# EAGLE design M_D_ext_power_8_0_2 (EAGLE 9.6.2)
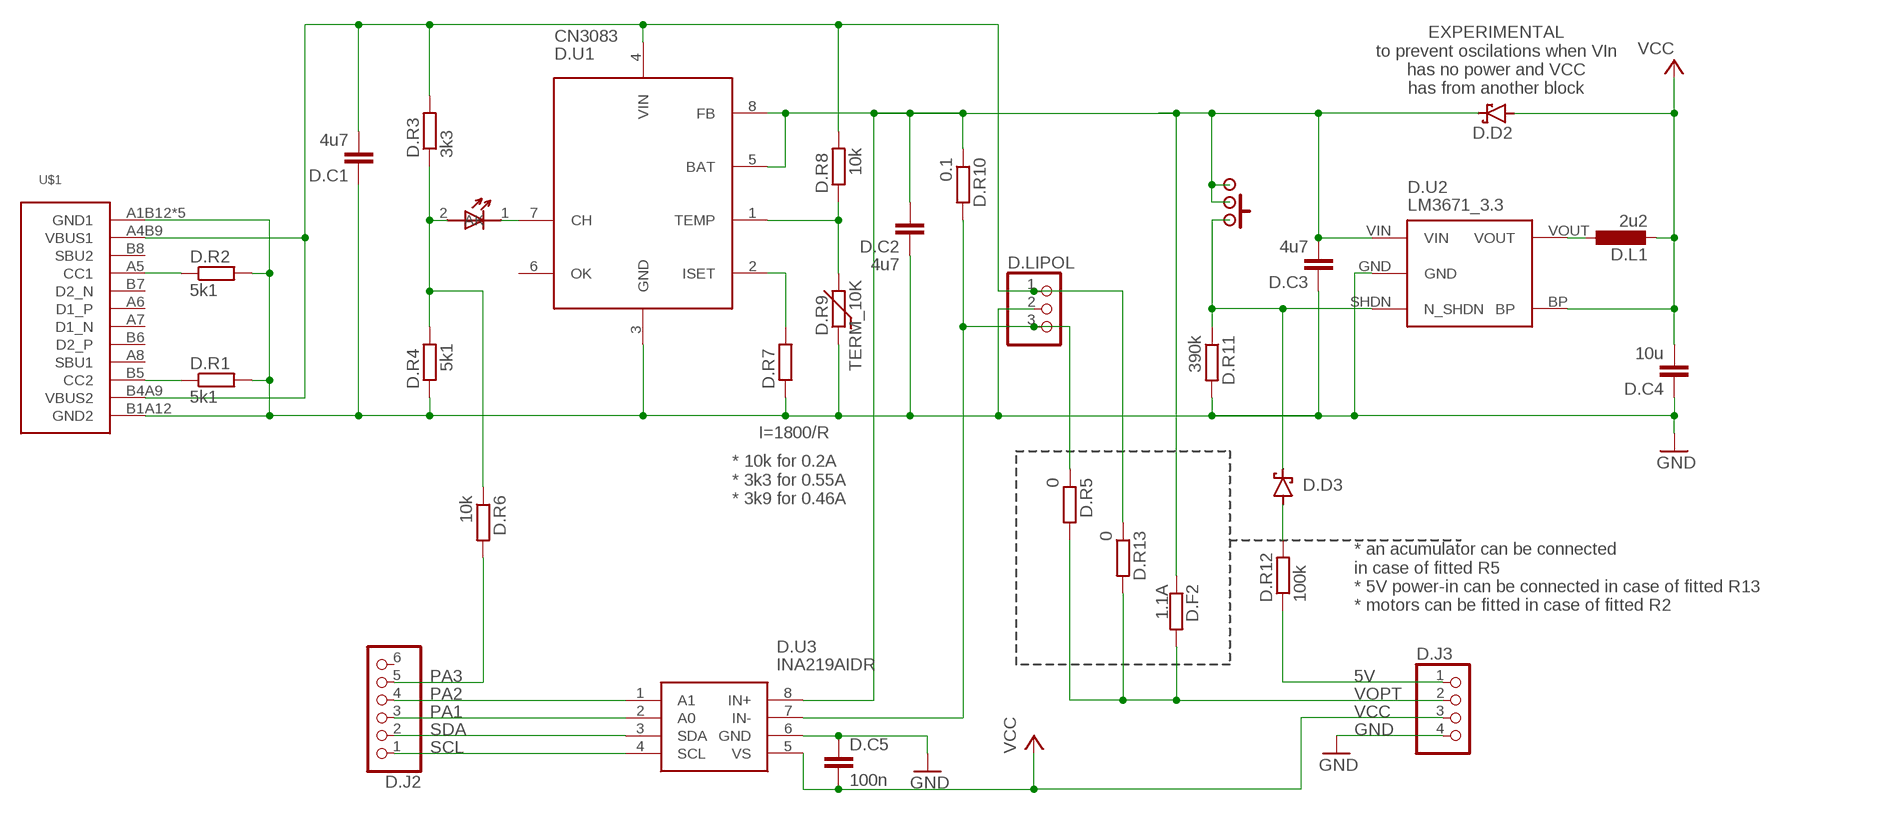
[diagram p0: schematic, sheet 1]

## Parts
D.C1  4u7  C-EUC0603  [C0603]
D.C2  4u7  C-EUC0603  [C0603]
D.C3  4u7  C-EUC0603  [C0603]
D.C4  10u  C-EUC0805  [C0805]
D.C5  100n  C-EUC0603  [C0603]
D.D1  LED_1.8  [LED_1.8]
D.D2  SHOTKY_2.8  [SHOTKY_2.8]
D.D3  SHOTKY_2.8  [SHOTKY_2.8]
D.F2  1.1A  R-EU_R0805  [R0805]
D.J2  PINHD-1X6  [1X06]
D.J3  PINHD-1X4  [1X04]
D.L1  2u2  L-EUL3230M  [L3230M]
D.LIPOL  PINHEAD-1X3-2  [1X-03-2]
D.ON/OFF/RESET  SWITCH  [SWITCH]
D.R1  5k1  R-EU_R0603  [R0603]
D.R2  5k1  R-EU_R0603  [R0603]
D.R3  3k3  R-EU_R0603  [R0603]
D.R4  5k1  R-EU_R0603  [R0603]
D.R5  0  R-EU_R0603  [R0603]
D.R6  10k  R-EU_R0603  [R0603]
D.R7  I=1800/R  R-EU_R0603  [R0603]
D.R8  10k  R-EU_R0603  [R0603]
D.R9  TERM_10K  THERM  [THERM]
D.R10  0.1  R-EU_R0805  [R0805]
D.R11  390k  R-EU_R0603  [R0603]
D.R12  100k  R-EU_R0603  [R0603]
D.R13  0  R-EU_R0603  [R0603]
D.U1  CN3083  [SOP8]
D.U2  LM3671_3.3  STABILISER_APE8865  [SOT32-5]
D.U3  INA219AIDR  [SOIC127P600X175-8N]
U$1  USB-C  [USB-C]

## Nets
5V: D.C1.2 D.LIPOL.1 D.R3.2 D.R8.2 D.R13.1 D.U1.4(VIN) U$1.A4B9(VBUS1) U$1.B4A9(VBUS2)
CHRG: D.D1.2(A) D.R3.1 D.R4.2 D.R6.1
GND: D.C1.1 D.C2.1 D.C3.1 D.C4.1 D.C5.1 D.J3.4 D.LIPOL.2 D.R1.2 D.R2.2 D.R4.1 D.R7.1 D.R9.1 D.R11.2 D.U1.3(GND) D.U2.GND D.U3.6(GND) U$1.A1B12(GND1) U$1.B1A12(GND2) U$1.SH1(GND1) U$1.SH2(GND1) U$1.SH3(GND1) U$1.SH4(GND1)
IN+: D.LIPOL.3 D.R5.1 D.R10.2 D.U3.7(IN-)
IN-: D.C2.2 D.C3.2 D.D2.K(C) D.F2.1 D.ON/OFF/RESET.P$2 D.ON/OFF/RESET.P$3 D.ON/OFF/RESET.P$4 D.ON/OFF/RESET.P$6 D.R10.1 D.U1.5(BAT) D.U1.8(FB) D.U2.VIN D.U3.8(IN+)
N$2: D.L1.1 D.U2.VOUT
N$3: D.D1.1(K) D.U1.7(CH)
N$4: D.R1.1 U$1.B5(CC2)
N$5: D.D3.A D.R12.2
N$6: D.R2.1 U$1.A5(CC1)
N$7: D.R7.2 D.U1.2(ISET)
N$8: D.R8.1 D.R9.2 D.U1.1(TEMP)
N$10: D.D3.K(C) D.ON/OFF/RESET.P$1 D.ON/OFF/RESET.P$5 D.ON/OFF/RESET.P$7 D.R11.1 D.U2.SHDN(N_SHDN)
PA1: D.J2.3 D.U3.2(A0)
PA2: D.J2.4 D.U3.1(A1)
PA3: D.J2.5 D.R6.2
PA5-1: D.J3.1 D.R12.1
SCL: D.J2.1 D.U3.4(SCL)
SDA: D.J2.2 D.U3.3(SDA)
VCC: D.C4.2 D.C5.2 D.D2.A D.J3.3 D.L1.2 D.U2.BP D.U3.5(VS)
VOPT: D.F2.2 D.J3.2 D.R5.2 D.R13.2
Unconnected: D.J2.6 D.U1.6(OK) U$1.A6(D1_P) U$1.A7(D1_N) U$1.A8(SBU1) U$1.B6(D2_P) U$1.B7(D2_N) U$1.B8(SBU2)

## Notes on the sheet
- EXPERIMENTAL
  to prevent oscilations when VIn
  has no power and VCC
  has from another block
- * 10k for 0.2A
  * 3k3 for 0.55A
  * 3k9 for 0.46A
- * an acumulator can be connected 
  in case of fitted R5  
  * 5V power-in can be connected in case of fitted R13 
  * motors can be fitted in case of fitted R2

## Library data of the parts
D.C1-D.C5 = rcl:C-EU: CAPACITOR, European symbol; SPICEPREFIX: C
D.D1 = hugo:LED_1.8
D.D2 D.D3 = hugo:SHOTKY_2.8
D.F2 D.R1-D.R8 D.R10-D.R13 = rcl:R-EU_: RESISTOR, European symbol; SPICEPREFIX: R
D.J2 = pinhead2:PINHD-1X6: PIN HEADER
D.J3 = pinhead2:PINHD-1X4: PIN HEADER
D.L1 = rcl:L-EU: INDUCTOR, European symbol; SPICEPREFIX: L
D.LIPOL = pinhead2:PINHEAD-1X3-2
D.ON/OFF/RESET = hugo:SWITCH
D.R9 = hugo:THERM
D.U1 = hugo:CN3083
D.U2 = !stavebnice03:STABILISER_APE8865
D.U3 = SamacSys_Parts:INA219AIDR: 26-V, Bidirectional, Zero-Drift, High-Side, I2C Out Current/Power Monitor Source: Datasheet <http://www.ti.com/lit/gpn/ina219>; DESCRIPTION: 26-V, Bidirectional, Zero-Drift, High-Side, I2C Out Current/Power Monitor; HEIGHT: 1.75mm; MANUFACTURER_NAME: Texas Instruments; MANUFACTURER_PART_NUMBER: INA219AIDR; MOUSER_PART_NUMBER: 595-INA219AIDR; MOUSER_PRICE-STOCK: https://www.mouser.co.uk/ProductDetail/Texas-Instruments/INA219AIDR?qs=XGzIaZb%2FFYIE5YcOHTnKDA%3D%3D
U$1 = hugo:USB-C

## Board
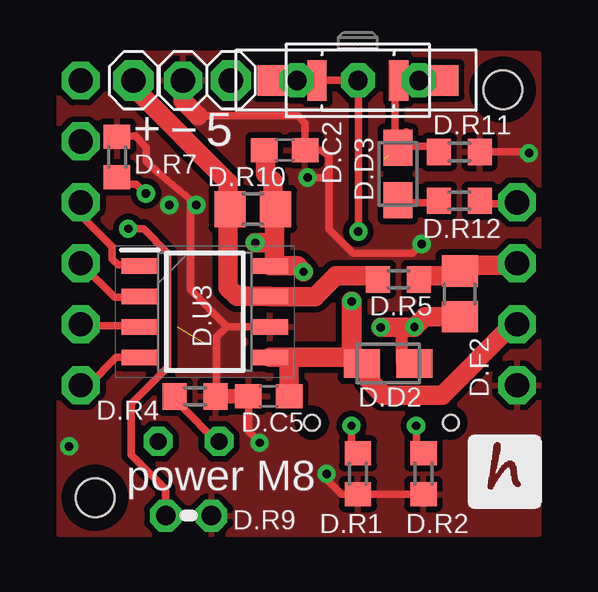
[diagram p1: board, top side]
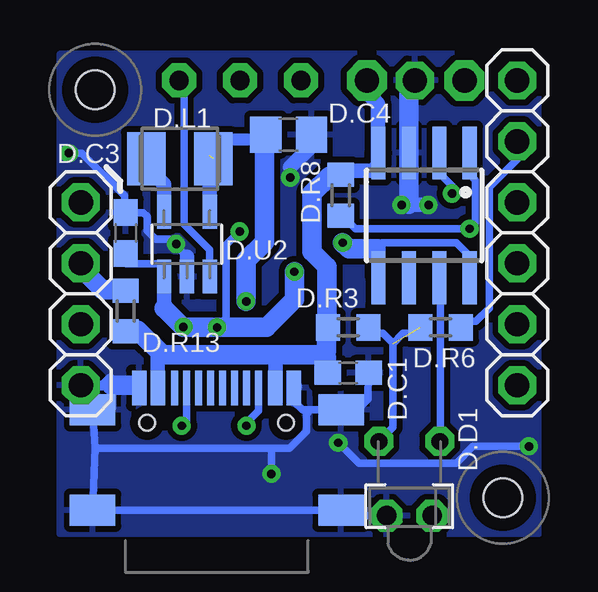
[diagram p2: board, bottom side, seen from below]

No outline drawn. Coordinates in mm, seen from the top.
Copper layers (1*16): Top 0.035mm / dielectric 1.5mm / Bottom 0.035mm
Design rules "default *": minimum track width 10mil, minimum drill 0.35mm, track to track 6mil, track to pad 6mil, pad to pad 6mil, via to via 10mil, smd to smd 10mil, copper to edge 15mil, drill to drill 15mil, minimum pad ring 10mil, minimum via ring 8mil, stop-mask expansion 4mil, vias tented up to drill 14mil, thermal gap 10mil
Holes 1.6 mm at 2,2 19,19
tRestrict: area 18,18 to 20,20; area 1,1 to 3,3
bRestrict: area 1,1 to 3,3; area 18,18 to 20,20

### Footprints (pad centres in the part's own frame; a part is rotated, then mirrored left to right if it is on the bottom)
C0603 = smd 1.1 x 1: 1 -0.85,0; 2 0.85,0
C0805 = smd 1.3 x 1.5: 1 -0.95,0; 2 0.95,0
LED_1.8 = drill 0.7 octagon: 1 -1.27,-0.4; 2 1.27,-0.4
SHOTKY_2.8 = smd 1.5 x 1.2: A -1.1,0; K 1.1,0
R0805 = smd 1.3 x 1.5: 1 -0.95,0; 2 0.95,0
1X06 = drill 1.016 pad 1.575 octagon: 1 -6.35,0; 2 -3.81,0; 3 -1.27,0; 4 1.27,0; 5 3.81,0; 6 6.35,0
1X04 = drill 1.016 pad 1.575 octagon: 1 -3.81,0; 2 -1.27,0; 3 1.27,0; 4 3.81,0
L3230M = smd 1.6 x 2.2: 1 -1.4,0; 2 1.4,0
1X-03-2 = drill 1.016 pad 1.676 octagon: 1 -2.016,0; 3 2.048,0 | drill 1.016 pad 1.575 octagon: 2 -0.016,0
SWITCH = drill 0.8 pad 1.422 octagon: P$1 2.54,0; P$2 0,0; P$3 -2.54,0 | smd 0.8 x 1.7: P$4 -1.7,0; P$5 1.7,0 | smd 1.27 x 1.27: P$6 -3.556,0; P$7 3.556,0
R0603 = smd 1 x 1.1: 1 -0.85,0; 2 0.85,0
THERM = drill 0.813 octagon: 1 -0.953,0; 2 0.953,0
SOP8 = smd 0.6 x 2.2: 1 -1.905,-2.6; 2 -0.635,-2.6; 3 0.635,-2.6; 4 1.905,-2.6; 5 1.905,2.6; 6 0.635,2.6; 7 -0.635,2.6; 8 -1.905,2.6
SOT32-5 = smd 0.6 x 1.4: BP 0.95,1.35; GND 0,-1.35; SHDN 0.95,-1.35; VIN -0.95,-1.35; VOUT -0.95,1.35
SOIC127P600X175-8N = smd 1.528 x 0.65: 1 -2.711,1.905; 2 -2.711,0.635; 3 -2.711,-0.635; 4 -2.711,-1.905; 5 2.711,-1.905; 6 2.711,-0.635; 7 2.711,0.635; 8 2.711,1.905
USB-C = smd 0.6 x 1.45: A1B12 -3.235,3.825; A4B9 -2.46,3.825; B1A12 3.215,3.825; B4A9 2.44,3.825 | smd 0.3 x 1.45: A5 -1.26,3.825; A6 -0.26,3.825; A7 0.24,3.825; A8 1.24,3.825; B5 1.74,3.825; B6 0.74,3.825; B7 -0.76,3.825; B8 -1.76,3.825 | smd 1.9 x 1.3: SH1 -5.18,2.91; SH2 -5.18,-1.27; SH3 5.18,-1.27; SH4 5.18,2.91 | hole 0.65: 2.88,2.38; -2.9,2.38

### Placement (x,y rotation side)
D.C1  8.45,7.2 180 bottom
D.C2  9.91,16.49 180 top
D.C3  17.73,13.03 270 bottom
D.C4  10.93,17.13 180 bottom
D.C5  9.25,6.22 0 top
D.D1  5.9,3.95 180 bottom
D.D2  14.22,7.59 0 top
D.D3  14.63,15.49 90 top
D.F2  17.21,10.5 90 top
D.J2  1.4,13.04 90 bottom
D.J3  19.6,10.5 270 bottom
D.L1  15.47,16.13 0 bottom
D.LIPOL  5.65,19.39 180 top
D.ON/OFF/RESET  12.96,19.39 0 top
D.R1  12.96,3 270 top
D.R2  15.7,3 270 top
D.R3  8.45,9.1 180 bottom
D.R4  6.17,6.22 180 top
D.R5  14.66,11.1 0 top
D.R6  4.6,9.1 0 bottom
D.R7  2.91,16.2 270 top
D.R8  8.76,14.61 90 bottom
D.R9  5.9,1.25 180 top
D.R10  8.58,14.03 180 top
D.R11  17.2,16.41 0 top
D.R12  17.2,14.38 180 top
D.R13  17.73,9.78 90 bottom
D.U1  5.28,13.77 180 bottom
D.U2  15.18,12.57 0 bottom
D.U3  6.58,9.75 0 top
U$1  13.93,2.75 0 bottom

### Tracks (layer width: path | path; a pad name or v marks a point on that pad's centre or on a via)
5V
  Bottom 0.254: D.R13.1 17.27,8.93 17.22,8.98 | 16.28,7.96 16.2,7.96
  Bottom 0.305: D.R3.2 9.36,9.16
  Bottom 0.61: 11.49,7.02 U$1.B4A9 11.49,7.87 11.4,7.96 | D.U1.4 7.21,16.37 | 7.21,16.37 7.21,15.86 7.44,15.63 8.59,15.63 D.R8.2 8.81,15.46 8.87,15.4 | U$1.A4B9 16.39,7.84 16.28,7.96 | 7.21,16.37 7.21,18.42 7.73,18.94 D.LIPOL.1
  Bottom 0.813: 8.87,15.4 9.23,15.4 9.95,14.68 9.95,12.25 9.32,11.62 9.32,9.07 | D.C1.2 9.33,7.23 9.35,7.84 9.46,7.96 9.51,7.96 | 9.51,7.96 11.4,7.96 16.2,7.96 17.22,8.98 | D.R3.2 9.32,9.07 | 9.32,9.07 9.35,9.05 9.35,8.12 9.51,7.96
CHRG  (1 unrouted)
  Top 0.305: D.R4.2 5.58,5.97 5.58,5.82 7.05,4.35 D.D1.2
  Bottom 0.254: D.R6.1 5.64,9.1 5.89,8.85
  Bottom 0.305: D.R3.1 7.61,8.85 7,8.85 6.59,8.44 | 5.89,8.85 6.16,8.85 6.59,8.41 6.59,4.94 D.D1.2
GND  (via drill 0.35)
  Top 0.305: v11.65,3 11.65,2.77 12.27,2.15 D.R1.2 D.R2.2 | 2.86,17.13 D.R7.1 | D.R7.1 3.14,16.86 | D.R7.1 3.67,17.08 4.14,16.61 4.14,16.03 4.61,15.55 v6.22,14.2 5.98,14.37 5.98,10.66 7.51,9.13 7.07,8.7 7.07,6.27 D.R4.1 | D.U3.6 7.52,9.12 | D.R11.2 20.04,16.41 v20.09,16.36 | v15.62,12.57 15.24,12.19 12.75,12.19 11.76,13.18 11.76,16.2 11.47,16.49 D.C2.1 10.76,17.61 10.46,17.91 6.3,17.91 | v10.87,15.34 11.57,15.34 | v8.87,4.29 8.4,4.76 D.C5.1
  Top 0.61: 8.38,6.21 8.09,6.22 8.02,6.22 D.R4.1 | 5.67,18.54 D.LIPOL.2
  Top 0.813: D.C5.1 8.38,6.21 | 6.3,17.91 5.67,18.54
  Bottom 0.305: 11.65,4.07 18.99,4.07 19.01,4.09 | U$1.SH4 8.92,5.71 9.45,5.71 9.33,5.59 8.13,5.59 7.62,6.1 D.C1.1 | U$1.SH1 19.01,4.09 | 19.01,4.09 U$1.SH2 U$1.SH3 8.64,1.25 D.R9.1 | 11.65,3.13 v11.65,3 | v11.65,3 11.63,2.97 | v11.65,3 11.65,4.07 | U$1.B1A12 10.71,6.01 10.37,5.66 U$1.SH4 | 11.65,4.07 10.89,4.07 10.19,4.78 10.19,5.49 10.02,5.66 U$1.SH4 | v20.09,16.36 19.56,16.36 17.78,14.58 17.78,13.93 D.C3.1 16.99,13.88 16.84,13.73 16.84,13.12 16.82,13.12 16.49,12.78 15.9,12.78 15.18,12.05 | v0.91,4.14 3.24,4.14 3.95,3.44 8.01,3.44 v8.87,4.29
  Bottom 0.406: 18.37,6.98 18.5,6.85 | 18.5,6.85 18.66,6.69 | U$1.A1B12 17.16,6.6 17.33,6.77 17.41,6.69 | 18.66,6.69 D.J3.4 19.6,6.25 | 18.66,6.69 18.31,6.69 | 18.5,6.85 18.34,6.68 18.34,5.71
  Bottom 0.508: 10.87,15.77 v10.87,15.34
  Bottom 0.61: 8.81,5.84 8.87,5.79 U$1.SH4 8.74,5.79 | 19.6,6.25 U$1.SH1 | U$1.B1A12 10.66,6.63 | D.U1.3 5.92,17.55 | v5.1,14.2 5.92,14.2 5.92,14.23 5.95,14.2 v6.22,14.2 | D.U2.GND 15.18,12.05 | D.LIPOL.2 5.92,19.21 | D.C4.1 9.98,16.65 10.87,15.77
  Bottom 0.813: 18.31,6.69 17.41,6.69 | 5.92,14.23 D.U1.3 5.92,19.21
  pour Top (isolate 0.254): 0.5,20.5 0.5,0.5 20.5,0.5 20.5,20.5
  pour Bottom (isolate 0.254, rank 3): 0.5,20.5 20.5,20.5 20.5,0.5 0.5,0.5
IN+
  Top 0.813: D.LIPOL.3 3.65,19.05 7.55,15.15 7.55,14.33 7.62,14.25 D.R10.2 7.62,13.57 7.54,13.49 7.54,10.76 7.91,10.39 D.U3.7 9.3,10.38 11.17,10.38 12.05,11.25 13.66,11.25 D.R5.1
IN-  (via drill 0.35)
  Top 0.305: 9.31,11.63 D.U3.8 9.39,11.76 9.39,12.62 | D.ON/OFF/RESET.P$6 D.ON/OFF/RESET.P$3 D.ON/OFF/RESET.P$4 D.ON/OFF/RESET.P$2 12.99,19.36 12.99,13.11 v12.98,13.09 | D.D2.K 15.3,7.62 14.79,7.62
  Top 0.508: 14.79,7.62 14.79,9.1 15.32,9.1
  Top 0.61: v8.68,12.62 9.39,12.62
  Top 0.813: D.R10.1 9.42,14.13 9.42,15.19 9.11,15.5 9.11,16.44 D.C2.2 | D.R10.1 9.61,14.03 | D.R10.1 9.47,13.97 9.47,12.62 | 9.47,12.62 9.47,11.66 10.08,11.66 | v8.68,12.62 9.47,12.62 | 17.35,9.6 17.26,9.6 D.F2.1 15.76,9.54 15.32,9.1 15.3,9.1 | D.U3.8 10.45,11.66 v10.69,11.42 | v15.32,9.12 15.3,9.1 | 15.3,9.1 14.83,9.1 | v13.92,9.1 14.79,9.1
  Bottom 0.305: D.U1.5 7.19,12.42 | 7.19,12.47 7.04,12.62 3.94,12.62 3.38,12.06 D.U1.8 | D.U2.VIN 16.13,11.67 16.2,11.75 17.71,11.75 D.C3.2 | v12.98,13.09 13.54,12.53 13.54,9.48 v13.92,9.1
  Bottom 0.508: 7.29,12.37 7.19,12.47
  Bottom 0.61: 7.19,11.76 D.U1.5 7.19,12.47 | D.U2.VIN 16.13,9.89
  Bottom 0.813: v8.68,12.62 8.43,12.37 7.29,12.37 | v10.69,11.42 10.69,10.26 11.86,9.1 v13.92,9.1 15.33,9.1 16.13,9.89
N$2
  Bottom 0.61: D.U2.VOUT 16.13,15.06 16.87,15.8 D.L1.1
N$3
  Bottom 0.305: D.U1.7 4.6,11.12 4.6,4.39 D.D1.1
N$4  (via drill 0.35)
  Top 0.305: D.R1.1 12.69,4.14 v12.69,5
  Bottom 0.305: U$1.B5 12.19,5.63 12.69,5.13 v12.69,5
N$5
  Top 0.305: D.D3.A 14.83,14.3 16.27,14.3 D.R12.2
N$6  (via drill 0.35)
  Top 0.305: v15.39,5 15.39,4.22 15.46,4.08 D.R2.1
  Bottom 0.305: U$1.A5 15.19,5.2 v15.39,5
N$7  (via drill 0.35)
  Top 0.305: 3.04,15.38 D.R7.2 2.91,15.06 3.71,15.06 4.09,14.68 v4.12,14.68
  Bottom 0.305: D.U1.2 4.65,15.53 4.07,14.95 4.07,14.73 v4.12,14.68
N$8  (via drill 0.35)
  Top 0.305: v3.38,13.21 4.02,13.21 5.03,12.2 5.03,7.44 3.5,5.92 3.5,3.8 4.95,2.35 D.R9.2
  Bottom 0.305: D.R8.1 8.69,13.76 8.14,13.21 v3.38,13.21 3.15,13.44 3.15,15.22 3.38,15.45 D.U1.1
N$10
  Top 0.305: 14.99,17.26 D.D3.K | D.ON/OFF/RESET.P$1 D.ON/OFF/RESET.P$5 14.51,19.2 14.51,17.02 D.D3.K | D.ON/OFF/RESET.P$1 15.36,19.35 | D.ON/OFF/RESET.P$1 D.ON/OFF/RESET.P$7 | D.R11.1 16.11,16.64 14.88,16.64 D.D3.K
  Bottom 0.305: D.U2.SHDN 14.23,12.33 15.3,13.41 15.3,19.19 D.ON/OFF/RESET.P$1
PA1
  Top 0.305: D.U3.2 3.83,10.35 2.81,10.35 D.J2.3
PA2
  Top 0.305: D.U3.1 3.82,11.71 2.96,11.71 2.72,11.95 2.72,12.45 1.4,13.77 D.J2.4
PA3
  Bottom 0.305: D.J2.5 1.4,16.11 2.57,14.94 2.57,9.9 3.12,9.35 3.49,9.35 D.R6.2
PA5-1
  Top 0.305: D.R12.1 18.01,14.26 19.55,14.26 D.J3.1
SCL
  Top 0.305: D.U3.4 2.89,7.85 1.73,6.69 D.J2.1
SDA
  Top 0.305: 3.86,9.13 D.U3.3 3.82,9.17 1.46,9.17 D.J2.2
VCC  (via drill 0.35)  (1 unrouted)
  Top 0.305: D.C5.2 10.25,6.08 | D.C5.2 10.32,6.24 | D.C5.2 10.19,6.13
  Top 0.508: 12.7,8.02 D.D2.A 12.82,7.59 12.57,7.85
  Top 0.61: D.U3.5 9.31,7.87
  Top 0.813: D.J3.3 19.43,9.23 16.48,6.28 14.02,6.28 13.41,6.89 13.41,7.37 12.7,8.08 v12.7,10.19 | 10.15,6.22 D.C5.2 10.1,7.85 | D.U3.5 10.1,7.85 | 10.1,7.85 12.57,7.85 12.7,7.98 | v12.7,10.19 | 12.7,8.02 v12.7,10.19
  Bottom 0.508: D.L1.2 14.07,16.48 13.61,16.94 12.09,16.94 11.99,16.84 11.94,16.79
  Bottom 0.61: 13.6,16.6 D.L1.2 | D.C4.2 11.93,17.17 | D.U2.BP 14.22,16.26 | 12.02,16.99 D.C4.2 | 11.99,17.02 D.C4.2
  Bottom 0.813: 11.99,16.84 11.99,17.02 | 11.94,16.79 11.94,12.65 12.7,11.89 v12.7,10.19
VOPT
  Top 0.813: D.J3.2 19.52,11.69 17.46,11.69 D.F2.2 17.02,11.25 15.86,11.25 15.71,11.1 D.R5.2
  Bottom 0.813: D.R13.2 17.77,10.66 18.69,10.66 19.6,11.58 D.J3.2

### Text on the board
tPlace: + | − | 5 | power M8